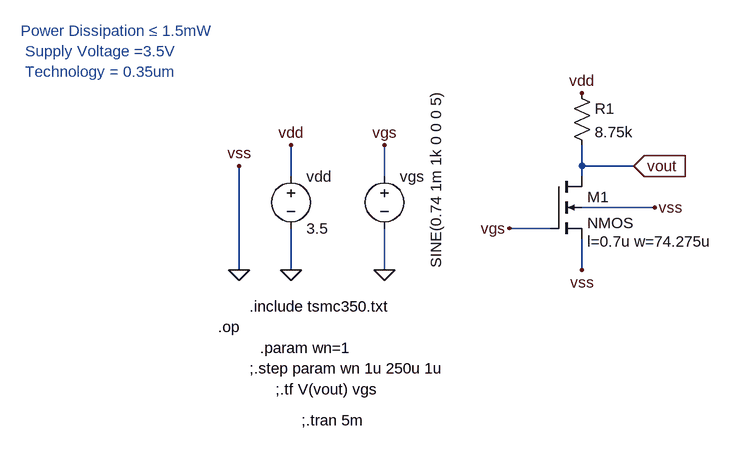
[diagram p0: schematic CS_amplifier1.asc]
CS_amplifier1.asc, the LTspice schematic file:
Version 4
SHEET 1 880 680
WIRE 320 112 320 80
WIRE 400 112 320 112
WIRE -128 128 -128 80
WIRE 16 128 16 80
WIRE 320 128 320 112
WIRE 432 176 320 176
WIRE 272 208 208 208
WIRE -208 272 -208 112
WIRE -128 272 -128 208
WIRE 16 272 16 208
WIRE 320 272 320 224
FLAG 16 272 0
FLAG -128 272 0
FLAG -208 272 0
FLAG -208 112 vss
FLAG -128 80 vdd
FLAG 16 80 vgs
FLAG 320 272 vss
FLAG 432 176 vss
FLAG 208 208 vgs
FLAG 320 0 vdd
FLAG 400 112 vout
IOPIN 400 112 In
SYMBOL nmos4 272 128 R0
WINDOW 123 56 100 Left 2
SYMATTR Value2 l=0.7u w=74.275u
SYMATTR InstName M1
SYMBOL voltage 16 112 R0
WINDOW 3 79 -115 VRight 2
WINDOW 123 0 0 Left 0
WINDOW 39 0 0 Left 0
SYMATTR Value SINE(0.74 1m 1k 0 0 0 5)
SYMATTR InstName vgs
SYMBOL voltage -128 112 R0
WINDOW 123 0 0 Left 0
WINDOW 39 0 0 Left 0
SYMATTR InstName vdd
SYMATTR Value 3.5
SYMBOL res 304 -16 R0
SYMATTR InstName R1
SYMATTR Value 8.75k
TEXT -192 328 Left 2 !.include tsmc350.txt
TEXT -240 360 Left 2 !.op
TEXT -176 392 Left 2 !.param wn=1
TEXT -192 424 Left 2 !;.step param wn 1u 250u 1u
TEXT -152 456 Left 2 !;.tf V(vout) vgs
TEXT -112 504 Left 2 !;.tran 5m
TEXT -544 -96 Left 2 ;Power Dissipation ≤ 1.5mW \n Supply Voltage =3.5V \n Technology = 0.35um

The netlist it stands for:
* CS_amplifier1.asc
M1 vout vgs 0 0 NMOS l=0.7u w=74.275u
vgs vgs 0 SINE(0.74 1m 1k 0 0 0 5)
vdd vdd 0 3.5
R1 vdd vout 8.75k
.model NMOS NMOS
.model PMOS PMOS
.lib standard.mos
.include tsmc350.txt
.op
.param wn=1
;.step param wn 1u 250u 1u
;.tf V(vout) vgs
;.tran 5m
* Power Dissipation ≤ 1.5mW
*  Supply Voltage =3.5V
*  Technology = 0.35um
.backanno
.end